# Altium project foxbms2-interface-mc33664.PrjPcb
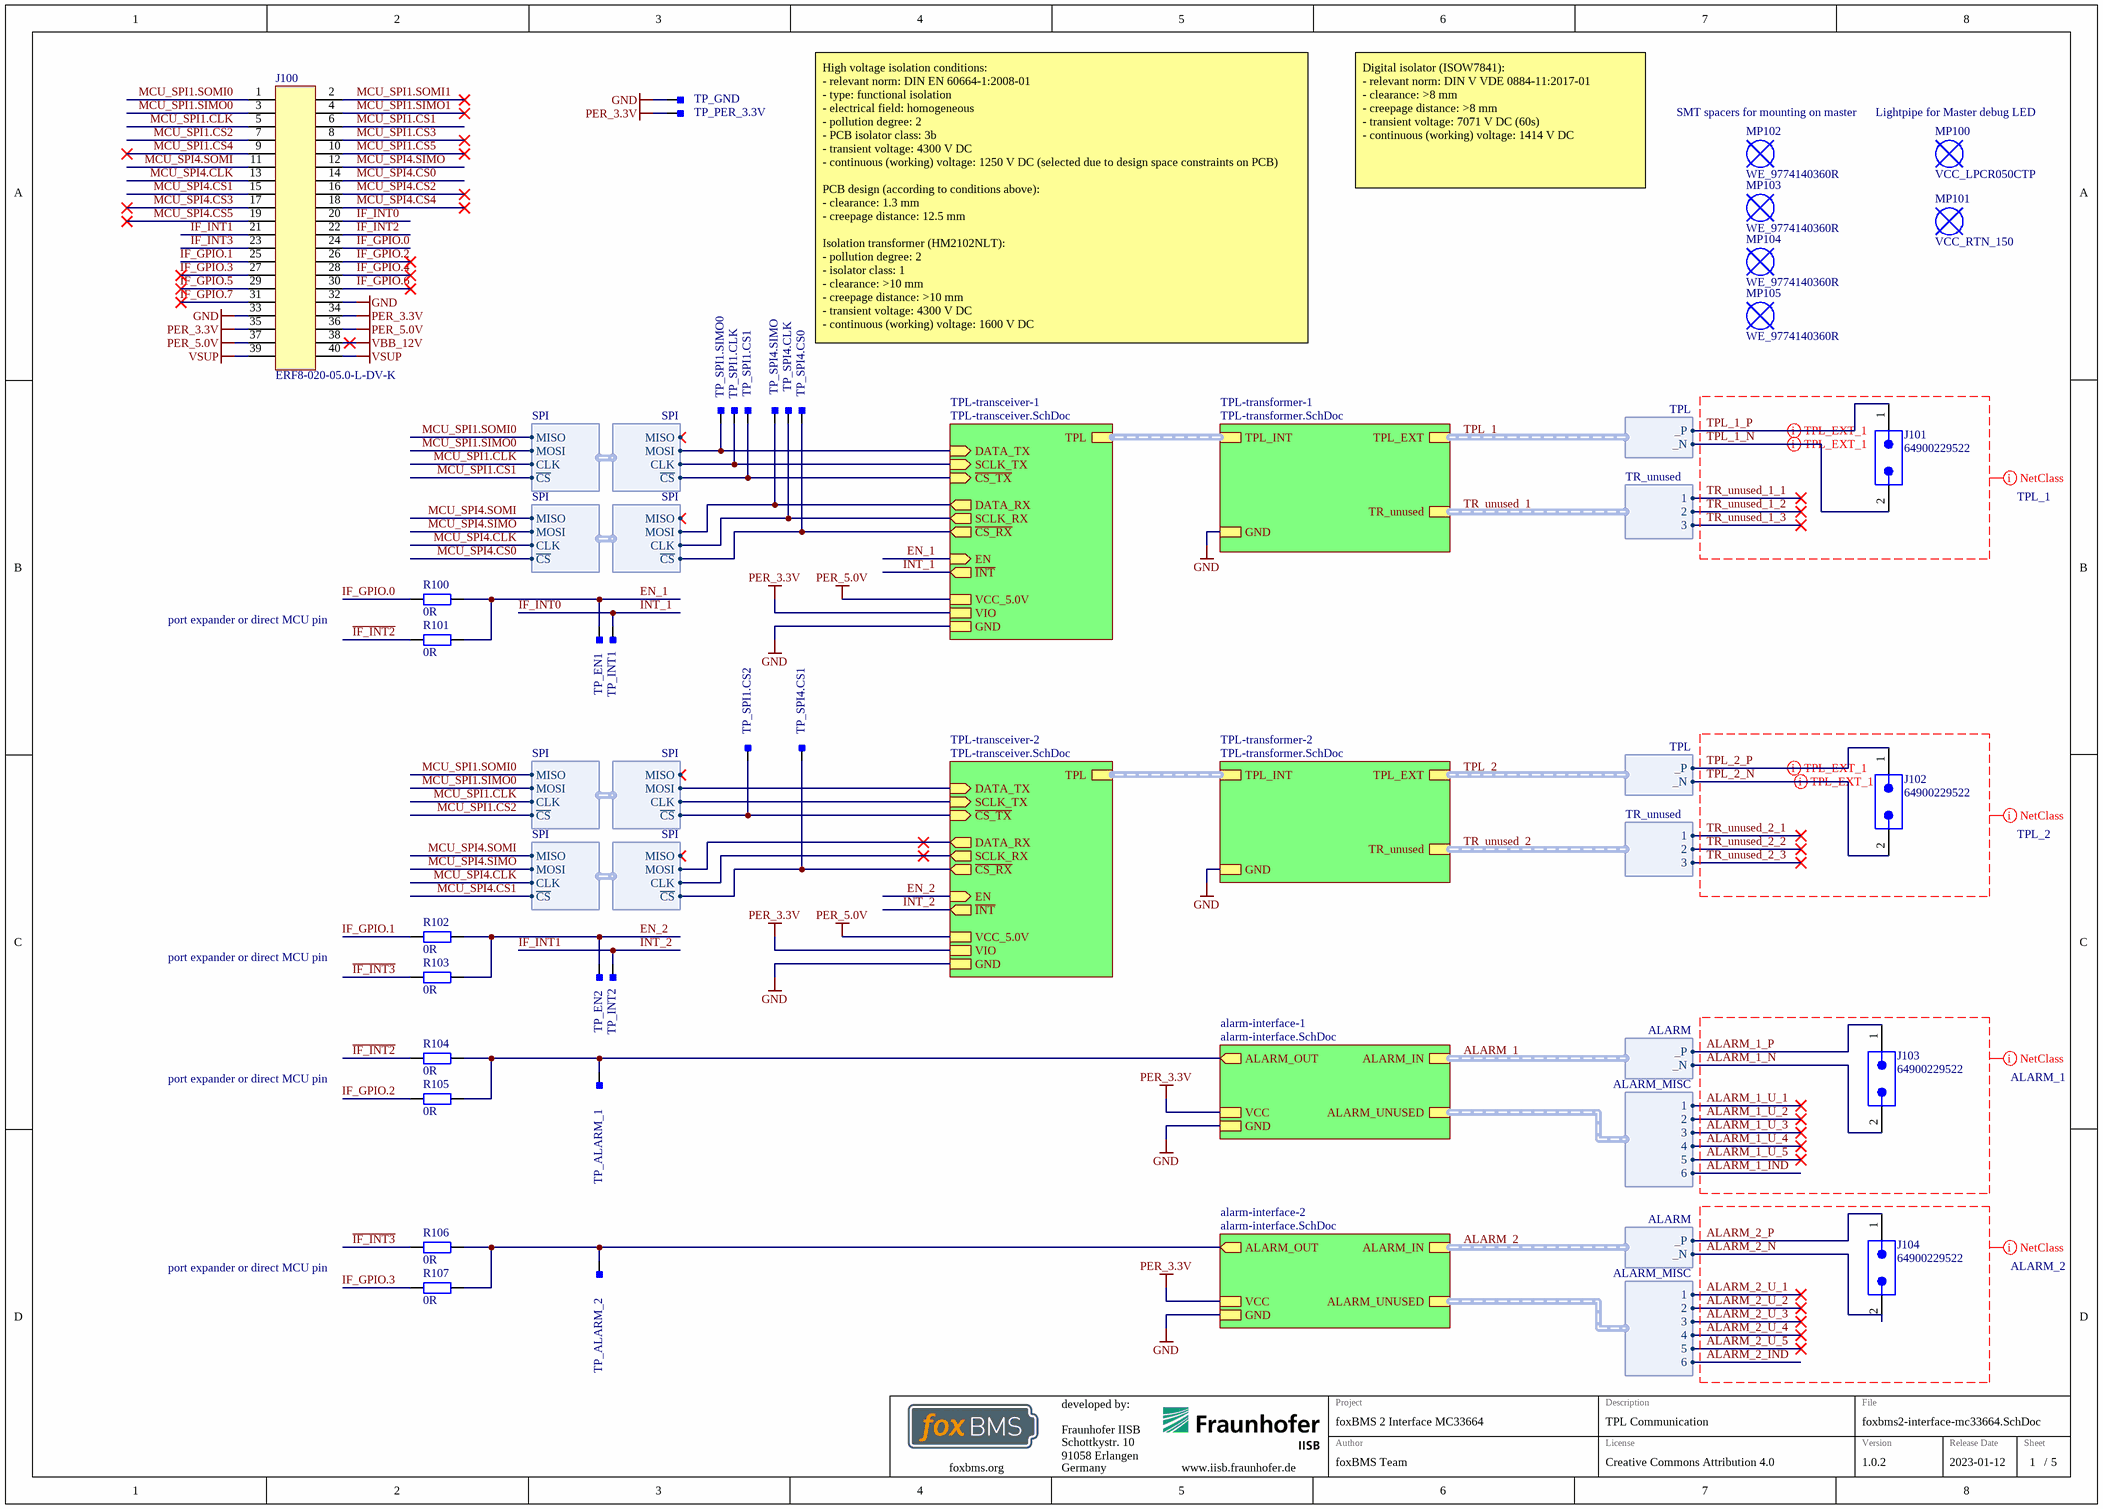
[diagram p0: foxbms2-interface-mc33664.SchDoc]
GlobalDate: 2023-01-12; GlobalLicense: Creative Commons Attribution 4.0; GlobalProject: foxBMS 2 Interface MC33664; GlobalVersion: 1.0.2
5 sheets, 111 parts. Net scope: strictly hierarchical (ports join the sheet entries above them; power ports are local).
Board file: foxbms2-interface-mc33664.PcbDoc
Sheets:
  foxbms2-interface-mc33664.SchDoc
    TPL-transceiver-1 = TPL-transceiver.SchDoc
    TPL-transformer-1 = TPL-transformer.SchDoc
    TPL-transformer-2 = TPL-transformer.SchDoc
    TPL-transceiver-2 = TPL-transceiver.SchDoc
    alarm-interface-1 = alarm-interface.SchDoc
      digital-isolator-alarm = digital-isolator-3in-1out-power.SchDoc
    alarm-interface-2 = alarm-interface.SchDoc
      digital-isolator-alarm = digital-isolator-3in-1out-power.SchDoc

## Sheet foxbms2-interface-mc33664.SchDoc
size A3; DocumentNumber: 1; SheetNumber: 1; SheetTotal: 5; SheetDescription: TPL Communication

### Parts
J100  ERF8-020-05.0-L-DV-K  [SAMTEC_ERF8-020-05.0-L-DV-K]
J101  64900229522  [64900229522]
J102  64900229522  [64900229522]
J103  64900229522  [64900229522]
J104  64900229522  [64900229522]
MP100  VCC_LPCR050CTP  [VCC_LPCR050TP]  (mechanical)
MP101  VCC_RTN_150  [VCC_RTN_150]  (mechanical)
MP102  WE_9774140360R  [WE_9774140360]
MP103  WE_9774140360R  [WE_9774140360]
MP104  WE_9774140360R  [WE_9774140360]
MP105  WE_9774140360R  [WE_9774140360]
R100  0R  [RESC1608X05N]
R101  0R  [RESC1608X05N]
R102  0R  [RESC1608X05N]
R103  0R  [RESC1608X05N]
R104  0R  [RESC1608X05N]
R105  0R  [RESC1608X05N]
R106  0R  [RESC1608X05N]
R107  0R  [RESC1608X05N]
TP_ALARM_1  Testpoint_Square  [Testpoint_S1]  (value not drawn)  (no BOM)
TP_ALARM_2  Testpoint_Square  [Testpoint_S1]  (value not drawn)  (no BOM)
TP_EN1  Testpoint_Square  [Testpoint_S1]  (value not drawn)  (no BOM)
TP_EN2  Testpoint_Square  [Testpoint_S1]  (value not drawn)  (no BOM)
TP_GND  Testpoint_Square  [Testpoint_S1]  (value not drawn)  (no BOM)
TP_INT1  Testpoint_Square  [Testpoint_S1]  (value not drawn)  (no BOM)
TP_INT2  Testpoint_Square  [Testpoint_S1]  (value not drawn)  (no BOM)
TP_PER_3.3V  Testpoint_Square  [Testpoint_S1]  (value not drawn)  (no BOM)
TP_SPI1.CLK  Testpoint_Square  [Testpoint_S1]  (value not drawn)  (no BOM)
TP_SPI1.CS1  Testpoint_Square  [Testpoint_S1]  (value not drawn)  (no BOM)
TP_SPI1.CS2  Testpoint_Square  [Testpoint_S1]  (value not drawn)  (no BOM)
TP_SPI1.SIMO0  Testpoint_Square  [Testpoint_S1]  (value not drawn)  (no BOM)
TP_SPI4.CLK  Testpoint_Square  [Testpoint_S1]  (value not drawn)  (no BOM)
TP_SPI4.CS0  Testpoint_Square  [Testpoint_S1]  (value not drawn)  (no BOM)
TP_SPI4.CS1  Testpoint_Square  [Testpoint_S1]  (value not drawn)  (no BOM)
TP_SPI4.SIMO  Testpoint_Square  [Testpoint_S1]  (value not drawn)  (no BOM)

### Sub-sheets
alarm-interface-1 = alarm-interface.SchDoc: GND, VCC, ALARM_IN (harness ALARM), ALARM_OUT (out), ALARM_UNUSED (harness ALARM_MISC)
alarm-interface-2 = alarm-interface.SchDoc: GND, VCC, ALARM_IN (harness ALARM), ALARM_OUT (out), ALARM_UNUSED (harness ALARM_MISC)
TPL-transceiver-1 = TPL-transceiver.SchDoc: GND, EN (in), TPL (harness TPL), VIO, SCLK_TX (in), ~{CS_RX} (out), ~{INT} (out), DATA_RX (out), ~{CS_TX} (in), VCC_5.0V, DATA_TX (in), SCLK_RX (out)
TPL-transceiver-2 = TPL-transceiver.SchDoc: GND, EN (in), TPL (harness TPL), VIO, SCLK_TX (in), ~{CS_RX} (out), ~{INT} (out), DATA_RX (out), ~{CS_TX} (in), VCC_5.0V, DATA_TX (in), SCLK_RX (out)
TPL-transformer-1 = TPL-transformer.SchDoc: GND, TPL_INT (harness TPL), TPL_EXT (harness TPL), TR_unused (harness TR_unused)
TPL-transformer-2 = TPL-transformer.SchDoc: GND, TPL_INT (harness TPL), TPL_EXT (harness TPL), TR_unused (harness TR_unused)

### Harnesses
SPI: CLK, MOSI, MISO, ~{CS}
TPL: _P, _N
TR_unused: 1, 2, 3
ALARM: _P, _N
ALARM_MISC: 1, 2, 3, 4, 5, 6

### Nets
ALARM_1_N: J103.2 ; sheet alarm-interface-1/ALARM_IN._N  [project net GND_ISO]
ALARM_2_N: J104.2 ; sheet alarm-interface-2/ALARM_IN._N  [project net GND_ISO]
GND: J100.32 J100.33 TP_GND.1 ; sheet TPL-transceiver-1/GND, sheet TPL-transformer-1/GND, sheet TPL-transformer-2/GND, sheet TPL-transceiver-2/GND, sheet alarm-interface-1/GND, sheet alarm-interface-2/GND
PER_3.3V: J100.34 J100.35 TP_PER_3.3V.1 ; sheet TPL-transceiver-1/VIO, sheet TPL-transceiver-2/VIO, sheet alarm-interface-1/VCC, sheet alarm-interface-2/VCC
PER_5.0V: J100.36 J100.37 ; sheet TPL-transceiver-1/VCC_5.0V, sheet TPL-transceiver-2/VCC_5.0V
VBB_12V: J100.38
VSUP: J100.39 J100.40
~{IF_INT0}: J100.20 TP_INT1.1 ; sheet TPL-transceiver-1/~{INT}  [also labelled ~{INT_1}]
~{IF_INT1}: J100.21 TP_INT2.1 ; sheet TPL-transceiver-2/~{INT}  [also labelled ~{INT_2}]
~{IF_INT2}: J100.22 R101.1 R104.1
~{IF_INT3}: J100.23 R103.1 R106.1
~{MCU_SPI1.CS1}: J100.6 TP_SPI1.CS1.1 ; sheet TPL-transceiver-1/~{CS_TX}, harness SPI.~{CS}
~{MCU_SPI1.CS2}: J100.7 TP_SPI1.CS2.1 ; sheet TPL-transceiver-2/~{CS_TX}, harness SPI.~{CS}
~{MCU_SPI1.CS3}: J100.8
~{MCU_SPI1.CS4}: J100.9
~{MCU_SPI1.CS5}: J100.10
~{MCU_SPI4.CS0}: J100.14 TP_SPI4.CS0.1 ; sheet TPL-transceiver-1/~{CS_RX}, harness SPI.~{CS}
~{MCU_SPI4.CS1}: J100.15 TP_SPI4.CS1.1 ; sheet TPL-transceiver-2/~{CS_RX}, harness SPI.~{CS}
~{MCU_SPI4.CS2}: J100.16
~{MCU_SPI4.CS3}: J100.17
~{MCU_SPI4.CS4}: J100.18
~{MCU_SPI4.CS5}: J100.19
ALARM_1_P: J103.1 ; sheet alarm-interface-1/ALARM_IN._P  [project net ALARM_1._P]
ALARM_2_P: J104.1 ; sheet alarm-interface-2/ALARM_IN._P  [project net ALARM_2._P]
ALARM_OUT: R104.2 R105.2 TP_ALARM_1.1 ; sheet alarm-interface-1/ALARM_OUT
ALARM_OUT: R106.2 R107.2 TP_ALARM_2.1 ; sheet alarm-interface-2/ALARM_OUT  [a separate net that carries the same name]
EN_1: R100.2 R101.2 TP_EN1.1 ; sheet TPL-transceiver-1/EN
EN_2: R102.2 R103.2 TP_EN2.1 ; sheet TPL-transceiver-2/EN
IF_GPIO.0: J100.24 R100.1
IF_GPIO.1: J100.25 R102.1
IF_GPIO.2: J100.26 R105.1
IF_GPIO.3: J100.27 R107.1
IF_GPIO.4: J100.28
IF_GPIO.5: J100.29
IF_GPIO.6: J100.30
IF_GPIO.7: J100.31
MCU_SPI1.CLK: J100.5 TP_SPI1.CLK.1 ; sheet TPL-transceiver-1/SCLK_TX, sheet TPL-transceiver-2/SCLK_TX, harness SPI.CLK
MCU_SPI1.SIMO0: J100.3 TP_SPI1.SIMO0.1 ; sheet TPL-transceiver-1/DATA_TX, sheet TPL-transceiver-2/DATA_TX, harness SPI.MOSI
MCU_SPI1.SIMO1: J100.4
MCU_SPI1.SOMI0: J100.1 ; harness SPI.MISO
MCU_SPI1.SOMI1: J100.2
MCU_SPI4.CLK: J100.13 TP_SPI4.CLK.1 ; sheet TPL-transceiver-1/SCLK_RX, sheet TPL-transceiver-2/SCLK_RX, harness SPI.CLK
MCU_SPI4.SIMO: J100.12 TP_SPI4.SIMO.1 ; sheet TPL-transceiver-1/DATA_RX, sheet TPL-transceiver-2/DATA_RX, harness SPI.MOSI
MCU_SPI4.SOMI: J100.11 ; harness SPI.MISO
TPL_1_N: J101.2 ; sheet TPL-transformer-1/TPL_EXT._N  [project net TPL_1._N]
TPL_1_P: J101.1 ; sheet TPL-transformer-1/TPL_EXT._P  [project net TPL_1._P]
TPL_2_N: J102.2 ; sheet TPL-transformer-2/TPL_EXT._N  [project net TPL_2._N]
TPL_2_P: J102.1 ; sheet TPL-transformer-2/TPL_EXT._P  [project net TPL_2._P]

### Buses and harness runs
harness ALARM_1 = sheet alarm-interface-1/ALARM_IN
harness ALARM_2 = sheet alarm-interface-2/ALARM_IN
harness sheet TPL-transceiver-1/TPL = sheet TPL-transformer-1/TPL_INT
harness sheet TPL-transceiver-2/TPL = sheet TPL-transformer-2/TPL_INT
harness TPL_1 = sheet TPL-transformer-1/TPL_EXT
harness TPL_2 = sheet TPL-transformer-2/TPL_EXT
harness TR_unused_1 = sheet TPL-transformer-1/TR_unused
harness TR_unused_2 = sheet TPL-transformer-2/TR_unused

### Layout directives
net class TPL_1: TPL_1_N, TPL_1_P, TR_unused_1_1, TR_unused_1_2, TR_unused_1_3
net class TPL_2: TPL_2_N, TPL_2_P, TR_unused_2_1, TR_unused_2_2, TR_unused_2_3
differential pair: TPL_1._N, TPL_1._P, TPL_2._N, TPL_2._P
net class ALARM_1: ALARM_1_IND, ALARM_1_N, ALARM_1_P, ALARM_1_U_1, ALARM_1_U_2, ALARM_1_U_3, ALARM_1_U_4, ALARM_1_U_5
net class ALARM_2: ALARM_2_IND, ALARM_2_N, ALARM_2_P, ALARM_2_U_1, ALARM_2_U_2, ALARM_2_U_3, ALARM_2_U_4, ALARM_2_U_5

### Notes on the sheet
- Digital isolator (ISOW7841):
  - relevant norm: DIN V VDE 0884-11:2017-01
  - clearance: >8 mm
  - creepage distance: >8 mm
  - transient voltage: 7071 V DC (60s)
  - continuous (working) voltage: 1414 V DC
- (near MP102) SMT spacers for mounting on master
- (near MP100) Lightpipe for Master debug LED
- High voltage isolation conditions:
  - relevant norm: DIN EN 60664-1:2008-01
  - type: functional isolation
  - electrical field: homogeneous
  - pollution degree: 2
  - PCB isolator class: 3b
  - transient voltage: 4300 V DC
  - continuous (working) voltage: 1250 V DC (selected due to design space constraints on PCB)
  PCB design (according to conditions above):
  - clearance: 1.3 mm
  - creepage distance: 12.5 mm
  Isolation transformer (HM2102NLT):
  - pollution degree: 2
  - isolator class: 1
  - clearance: >10 mm
  - creepage distance: >10 mm
  - transient voltage: 4300 V DC
  - continuous (working) voltage: 1600 V DC
- port expander or direct MCU pin
- Fraunhofer IISB
- Schottkystr. 10
- developed by:
- 91058 Erlangen
- Germany
- Author
- Project
- License
- Description
- File
- Version
- Release Date
- Sheet
- foxbms.org <https://foxbms.org>
- www.iisb.fraunhofer.de <https://www.iisb.fraunhofer.de/>
- foxBMS Team
- /

### Library data of the parts
J100 = SAMTEC_ERF8-020-05.0-L-DV-K: Edge Rate rugged high-speed connector strips; Manufacturer: Samtec; Circuits: 40; Automotive Qualified: False; Part Number: SAMTEC_ERF8-020-05.0-L-DV-K; Part Name: ERF8-020-05.0-L-DV-K; Operating Temperature: -55°C - +125°C; ComponentLink1Description: Datasheet; ComponentLink1URL: https://suddendocs.samtec.com/catalog_english/erf8-s.pdf; Supplier 1: Farnell; Supplier Part Number 1: 3771957; Supplier 2: Digikey; Supplier Part Number 2: SAM13550CT-ND; Supplier 3: Mouser; Supplier Part Number 3: 200-ERF8020050LDVKTR; ECCN: EAR99; System: Connector
J101-J104 = CMP-1502-00517-2: NexarPartId: 8917583; Operating Supply Voltage: 600V; Connector Type: Male Pin, Socket; Gender: Male; Current Rating: 9A; Insulation: Insulated; Insulation Resistance: 1GΩ; Number of Positions: 2; Contact Resistance: 10mΩ; Row Spacing: 5.5118mm; Pitch: 4.2mm; Contact Material: Copper; RoHS: Compliant; Lead Pitch: 4.2mm; Min Operating Temperature: -40°C; Housing Material: Nylon; Width: 5.4mm; Color: White; Number of Pins: 2; Mount: Through Hole; Number of Rows: 2; Fastening Type: Ramp; Flammability Rating: UL94 V-0; Termination: Through Hole; Height: 12.8mm; Length: 5.4mm; Contact Plating: Tin; Contact Gender: Male; Number of Contacts: 2; Max Operating Temperature: 105°C; REACH SVHC: Unknown; Voltage Rating: 600V
MP100 = VCC_LPCR050CTP: Lightpipe Clear LPCR Series; Manufacturer: VCC; Automotive Qualified: False; Part Number: VCC_LPCR050CTP; Part Name: VCC_LPCR050CTP; ComponentLink1Description: Datasheet; ComponentLink1URL: https://vcclite.com/wp-content/uploads/wpallimport/files/files/LPCR.pdf; Supplier 1: Digikey; Supplier Part Number 1: LPCR050CTP-ND; Supplier 2: Mouser; Supplier Part Number 2: 593-LPCR050CTP; ECCN: EAR99
MP101 = VCC_RTN_150: Grommet Retainer for LPC and LPCR Series Light Pipe; Manufacturer: VCC; Automotive Qualified: False; Part Number: VCC_RTN_150; Part Name: VCC_RTN_150; ComponentLink1Description: Datasheet; ComponentLink1URL: https://vcclite.com/?file=files/RTN_150.pdf&file_name=RTN_150.pdf; Supplier 1: Digikey; Supplier Part Number 1: RTN_150-ND; Supplier 2: Mouser; Supplier Part Number 2: 593-RTN150; ECCN: EAR99
MP102-MP105 = WE_9774140360R: WA-SMSI SMT Steel Spacer with internal thread M 3; Manufacturer: Würth Elektronik; Automotive Qualified: False; Part Number: WE_9774140360R; Part Name: WE_9774140360R; Operating Temperature: -55°C - +150°C; ComponentLink1Description: Datasheet; ComponentLink1URL: https://www.we-online.com/catalog/datasheet/9774140360R.pdf; Supplier 1: Digikey; Supplier Part Number 1: 732-5281-1-ND; Supplier 2: Mouser; Supplier Part Number 2: 710-9774140360R; ECCN: EAR99
R100-R107 = gen_R_0R_0603: SMD Resistor 0R 0603; Power: 0.1W; Case EIA: 0603; Case Metric: 1608; Maximum Working Voltage: 75V; PnP Package: 0603R; PnP equipped: x; Automotive Qualified: True; Part Number: gen_R_0R_0603; Operating Temperature: -55°C - +155°C; Resistance: 0R; Series: Jumper; PnP Value: 0R; Supplier 1: Farnell; Supplier Part Number 1: 2616580
TP_ALARM_1 TP_ALARM_2 TP_EN1 TP_EN2 TP_GND TP_INT1 TP_INT2 TP_PER_3.3V TP_SPI1.CLK TP_SPI1.CS1 TP_SPI1.CS2 TP_SPI1.SIMO0 TP_SPI4.CLK TP_SPI4.CS0 TP_SPI4.CS1 TP_SPI4.SIMO = Testpoint_Square: Testpoint, square; Automotive Qualified: False; Part Number: Testpoint_Square

## Sheet TPL-transceiver.SchDoc
size A3; DocumentNumber: 4; SheetNumber: 4; SheetTotal: 5; SheetDescription: TPL Transceiver
Used 2 times, as channels TPL-transceiver-1, TPL-transceiver-2. Parts and nets are listed once, with the designators drawn on the sheet.
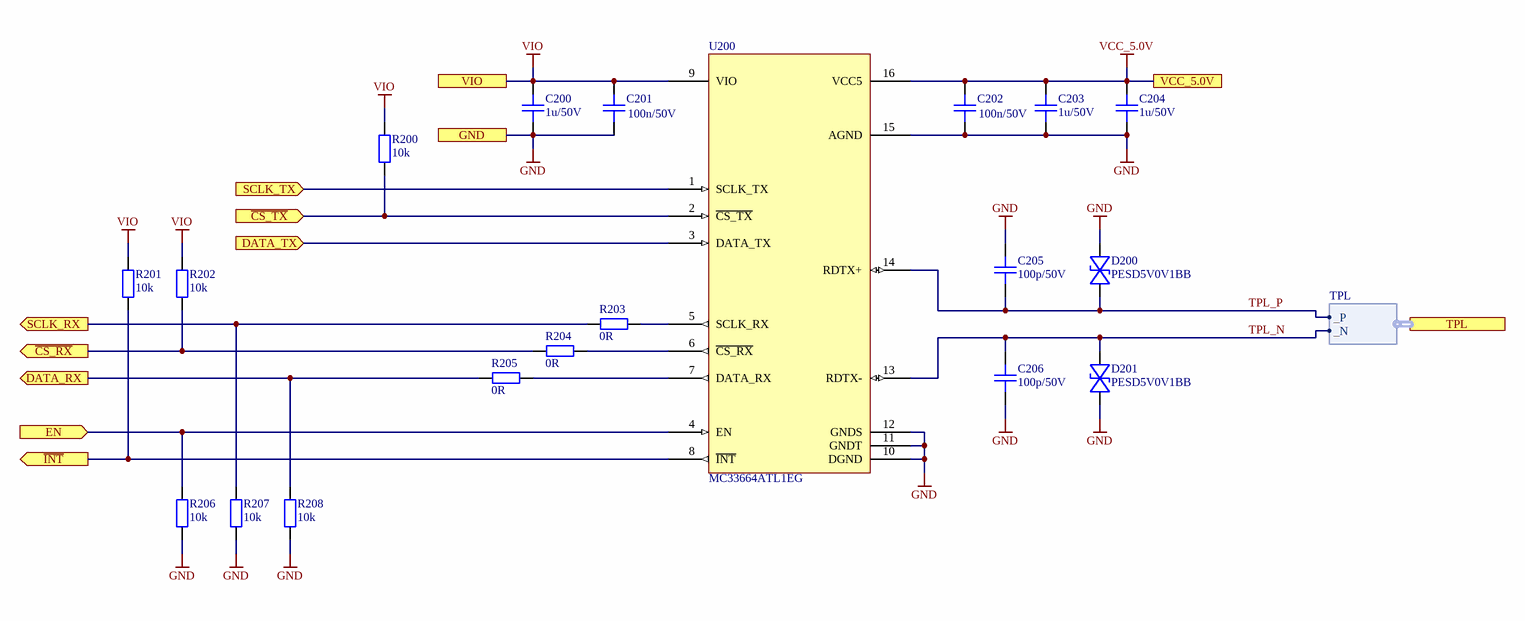
[diagram p1: TPL-transceiver.SchDoc]

### Parts
C200  1u/50V  [CAPC2012X14N]
C201  100n/50V  [CAPC1608X08N]
C202  100n/50V  [CAPC1608X08N]
C203  1u/50V  [CAPC2012X14N]
C204  1u/50V  [CAPC2012X14N]
C205  100p/50V  [CAPC1608X08N]
C206  100p/50V  [CAPC1608X08N]
D200  PESD5V0V1BB  [SOD523_PESD_NEXPERIA]
D201  PESD5V0V1BB  [SOD523_PESD_NEXPERIA]
R200  10k  [RESC1608X05N]
R201  10k  [RESC1608X05N]
R202  10k  [RESC1608X05N]
R203  0R  [RESC1608X05N]
R204  0R  [RESC1608X05N]
R205  0R  [RESC1608X05N]
R206  10k  [RESC1608X05N]
R207  10k  [RESC1608X05N]
R208  10k  [RESC1608X05N]
U200  MC33664ATL1EG  [MC33664ATL1EG]

### Ports
DATA_RX (out), DATA_TX (in), EN (in), GND, SCLK_RX (out), SCLK_TX (in), TPL (harness TPL), VCC_5.0V, VIO, ~{CS_RX} (out), ~{CS_TX} (in), ~{INT} (out)

### Harnesses
TPL: _P, _N

### Nets
GND: C200.1 C201.1 C202.1 C203.1 C204.1 C205.2 C206.1 D200.1(C) D201.2(A) R206.1 R207.1 R208.1 U200.10(DGND) U200.11(GNDT) U200.12(GNDS) U200.15(AGND) ; port GND
VCC_5.0V: C202.2 C203.2 C204.2 U200.16(VCC5) ; port VCC_5.0V
VIO: C200.2 C201.2 R200.2 R201.2 R202.2 U200.9(VIO) ; port VIO
~{CS_RX}: R202.1 R204.1 ; port ~{CS_RX}
~{CS_TX}: R200.1 U200.2(~{CS_TX}) ; port ~{CS_TX}
~{INT}: R201.1 U200.8(~{INT}) ; port ~{INT}
DATA_RX: R205.1 R208.2 ; port DATA_RX
DATA_TX: U200.3(DATA_TX) ; port DATA_TX
EN: R206.2 U200.4(EN) ; port EN
SCLK_RX: R203.1 R207.2 ; port SCLK_RX
SCLK_TX: U200.1(SCLK_TX) ; port SCLK_TX
TPL_N: C206.2 D201.1(C) U200.13(RDTX-) ; port TPL._N
TPL_P: C205.1 D200.2(A) U200.14(RDTX+) ; port TPL._P
NetR203_2: R203.2 U200.5(SCLK_RX)
NetR204_2: R204.2 U200.6(~{CS_RX})
NetR205_2: R205.2 U200.7(DATA_RX)

### Channels
TPL-transceiver-1: designators end in _1; ports DATA_RX=MCU_SPI4.SIMO DATA_TX=MCU_SPI1.SIMO0 EN=EN_1 GND=GND SCLK_RX=MCU_SPI4.CLK SCLK_TX=MCU_SPI1.CLK VCC_5.0V=PER_5.0V VIO=PER_3.3V ~{CS_RX}=~{MCU_SPI4.CS0} ~{CS_TX}=~{MCU_SPI1.CS1} ~{INT}=~{IF_INT0}
TPL-transceiver-2: designators end in _2; ports DATA_RX=MCU_SPI4.SIMO DATA_TX=MCU_SPI1.SIMO0 EN=EN_2 GND=GND SCLK_RX=MCU_SPI4.CLK SCLK_TX=MCU_SPI1.CLK VCC_5.0V=PER_5.0V VIO=PER_3.3V ~{CS_RX}=~{MCU_SPI4.CS1} ~{CS_TX}=~{MCU_SPI1.CS2} ~{INT}=~{IF_INT1}

### Notes on the sheet
- Fraunhofer IISB
- Schottkystr. 10
- developed by:
- 91058 Erlangen
- Germany
- Author
- Project
- License
- Description
- File
- Version
- Release Date
- Sheet
- foxbms.org <https://foxbms.org>
- www.iisb.fraunhofer.de <https://www.iisb.fraunhofer.de/>
- foxBMS Team
- /

### Library data of the parts
C200 C203 C204 = gen_C_ceramic_1u_50V_X7R_0805: MLCC; Capacitance: 1u; Rated Voltage: 50V; Dielectric: X7R; Tolerance: ± 10%; Case EIA: 0805; Case Metric: 2012; AVT Set: x; Automotive Qualified: True; Part Number: gen_C_ceramic_1u_50V_X7R_0805; Operating Temperature: -55°C - +125°C; Supplier 1: Farnell; Supplier Part Number 1: 2672199; Supplier 2: Farnell; Supplier Part Number 2: 2479894; Supplier 3: Farnell; Supplier Part Number 3: 2464630
C201 C202 = gen_C_ceramic_100n_50V_X7R_0603: MLCC; Capacitance: 100n; Rated Voltage: 50V; Dielectric: X7R; Case EIA: 0603; Case Metric: 1608; PnP Package: 0603C; PnP Value: 100nF/50V/X7R; PnP equipped: x; Automotive Qualified: True; AEC-Q Norm: AEC-Q200; Part Number: gen_C_ceramic_100n_50V_X7R_0603; Supplier 1: Farnell; Supplier Part Number 1: 2525267; ECCN: EAR99; Supplier 2: Digikey; Supplier Part Number 2: 490-6049-1-ND
C205 C206 = gen_C_ceramic_100p_50V_C0G_0603: MLCC; Capacitance: 100p; Rated Voltage: 50V; Dielectric: C0G; Tolerance: ± 10%; Case EIA: 0603; Case Metric: 1608; PnP Package: 0603C; PnP Value: 100pF/50V/NP0; PnP equipped: x; Automotive Qualified: True; AEC-Q Norm: AEC-Q200; Part Number: gen_C_ceramic_100p_50V_C0G_0603; Supplier 1: Farnell; Supplier Part Number 1: 2478236; ECCN: EAR99
D200 D201 = PESD5V0V1BB: Very low capacitance bidirectional ESD protection diode; Manufacturer: Nexperia; Breakdown Voltage: 6.8V; PnP Package: SOD523; Automotive Qualified: True; AEC-Q Norm: AEC-Q101; Part Number: PESD5V0V1BB; Part Name: PESD5V0V1BB; Operating Temperature: -55°C - +150°C; Continuous Forward Current: *; ComponentLink1Description: Datasheet; ComponentLink1URL: https://assets.nexperia.com/documents/data-sheet/PESD5V0V1BB.pdf; Supplier 1: Mouser; Supplier Part Number 1: 771-PESD5V0V1BB115; Supplier 2: Digikey; Supplier Part Number 2: 1727-5808-1-ND; Supplier 3: Farnell; Supplier Part Number 3: 2069367; ECCN: EAR99
R200-R202 R206-R208 = gen_R_10k_0603: SMD Resistor 10k 0603; Tolerance: 1%; Power: 0.1W; Case EIA: 0603; Case Metric: 1608; Maximum Working Voltage: 75V; PnP Package: 0603R; Automotive Qualified: True; PnP equipped: x; Part Number: gen_R_10k_0603; Operating Temperature: -55°C - +155°C; Resistance: 10k; Series: E24, E96; PnP Value: 10k; Supplier 1: Farnell; Supplier Part Number 1: 2073349
R203-R205 = gen_R_0R_0603: as R100 on sheet foxbms2-interface-mc33664; Part Number: gen_R_0R_0603; Operating Temperature: -55°C - +155°C; Resistance: 0R; Series: Jumper; PnP Value: 0R; Supplier 1: Farnell; Supplier Part Number 1: 2616580
U200 = MC33664ATL1EG: Isolated network high-speed transceiver; Manufacturer: NXP; PnP Package: SOT109-5; Automotive Qualified: True; Part Number: MC33664ATL1EG; Part Name: MC33664ATL1EG; Operating Temperature: -40°C - +125°C; ComponentLink1Description: Datasheet; ComponentLink1URL: https://www.nxp.com/docs/en/data-sheet/MC33664_SDS.pdf; Supplier 1: Mouser; Supplier Part Number 1: 841-MC33664ATL1EG; Supplier 2: Digikey; Supplier Part Number 2: 568-13893-ND / 568-13893-ND; Supplier 3: Farnell; Supplier Part Number 3: 2890308; ECCN: EAR99

## Sheet TPL-transformer.SchDoc
size A3; DocumentNumber: 5; SheetNumber: 5; SheetTotal: 5; SheetDescription: TPL Transformer
Used 2 times, as channels TPL-transformer-1, TPL-transformer-2. Parts and nets are listed once, with the designators drawn on the sheet.
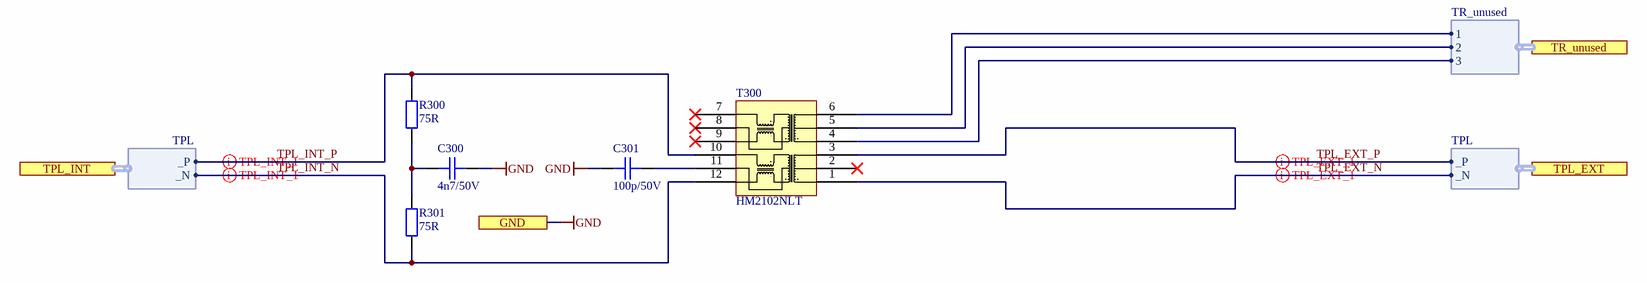
[diagram p2: TPL-transformer.SchDoc]

### Parts
C300  4n7/50V  [CAPC1608X08N]
C301  100p/50V  [CAPC1608X08N]
R300  75R  [RESC1608X05N]
R301  75R  [RESC1608X05N]
T300  HM2102NLT  [HM2102NL]

### Ports
GND, TPL_EXT (harness TPL), TPL_INT (harness TPL), TR_unused (harness TR_unused)

### Harnesses
TPL: _P, _N
TR_unused: 1, 2, 3

### Nets
GND: C300.2 C301.1 ; port GND
TPL_EXT_N: T300.1 ; port TPL_EXT._N
TPL_EXT_P: T300.3 ; port TPL_EXT._P
TPL_INT_N: R301.1 T300.12 ; port TPL_INT._N
TPL_INT_P: R300.2 T300.10 ; port TPL_INT._P
NetC300_1: C300.1 R300.1 R301.2
NetC301_2: C301.2 T300.11
NetT300_4: T300.4 ; port TR_unused.3
NetT300_5: T300.5 ; port TR_unused.2
NetT300_6: T300.6 ; port TR_unused.1

Not connected (* = marked no-connect by the designer): T300 2* 7* 8* 9*

### Channels
TPL-transformer-1: designators end in _1; ports GND=GND
TPL-transformer-2: designators end in _2; ports GND=GND

### Layout directives
differential pair: TPL_1._N, TPL_1._P, TPL_INT_N, TPL_INT_P

### Notes on the sheet
- Fraunhofer IISB
- Schottkystr. 10
- developed by:
- 91058 Erlangen
- Germany
- Author
- Project
- License
- Description
- File
- Version
- Release Date
- Sheet
- foxbms.org <https://foxbms.org>
- www.iisb.fraunhofer.de <https://www.iisb.fraunhofer.de/>
- foxBMS Team
- /

### Library data of the parts
C300 = gen_C_ceramic_4n7_50V_X7R_0603: MLCC; Capacitance: 4n7; Rated Voltage: 50V; Dielectric: X7R; Case EIA: 0603; Case Metric: 1608; PnP Package: 0603C; Automotive Qualified: True; Part Number: gen_C_ceramic_4n7_50V_X7R_0603; Supplier 1: Farnell; Supplier Part Number 1: 2904754
C301 = gen_C_ceramic_100p_50V_C0G_0603: as C205 on sheet TPL-transceiver; Part Number: gen_C_ceramic_100p_50V_C0G_0603; Supplier 1: Farnell; Supplier Part Number 1: 2478236; ECCN: EAR99
R300 R301 = gen_R_75R_0603: SMD Resistor 75R 0603; Tolerance: 1%; Power: 0.1W; Case EIA: 0603; Case Metric: 1608; Maximum Working Voltage: 75V; PnP Package: 0603R; Automotive Qualified: True; AEC-Q Grade: Grade 0; AEC-Q Norm: AEC-Q200; Part Number: gen_R_75R_0603; Operating Temperature: -55°C - +155°C; Resistance: 75R; Series: E24, E96; PnP Value: 75R; ECCN: EAR99; Supplier 1: Mouser; Supplier Part Number 1: 667-ERJ-UP3F75R0V
T300 = HM2102NLT: Pulse HM2102NLT BMS Transformer; Automotive Qualified: True; AEC-Q Norm: AEC-Q200; Part Number: HM2102NLT; Manufacturer: Pulse; Operating Temperature: -40°C - +125°C; ComponentLink1Description: Datasheet; ComponentLink1URL: https://www.mouser.de/datasheet/2/336/HM2102NL-1218600.pdf; Supplier 1: Mouser; Supplier Part Number 1: 673-HM2102NLT; Supplier 2: Digikey; Supplier Part Number 2: 1840-1034-1-ND; ECCN: EAR99

## Sheet alarm-interface.SchDoc
size A3; DocumentNumber: 2; SheetNumber: 2; SheetTotal: 5; SheetDescription: Alarm Interface
Used 2 times, as channels alarm-interface-1, alarm-interface-2. Parts and nets are listed once, with the designators drawn on the sheet.
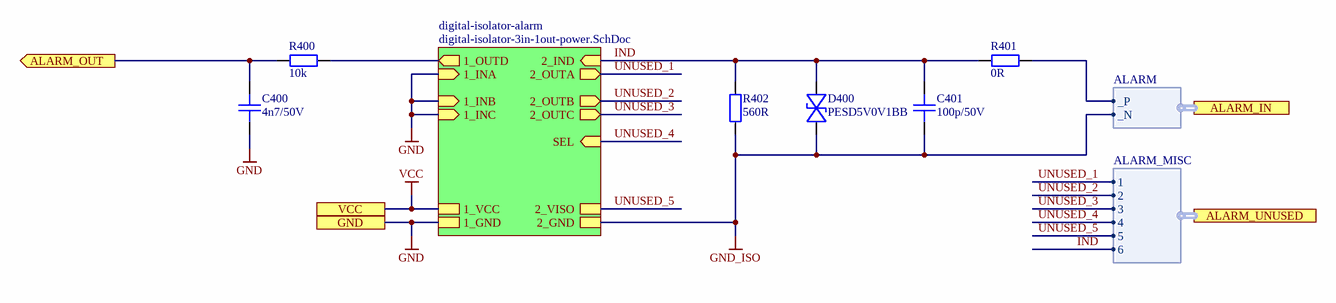
[diagram p3: alarm-interface.SchDoc]

### Parts
C400  4n7/50V  [CAPC1608X08N]
C401  100p/50V  [CAPC1608X08N]
D400  PESD5V0V1BB  [SOD523_PESD_NEXPERIA]
R400  10k  [RESC1608X05N]
R401  0R  [RESC1608X05N]
R402  560R  [RESC1608X05N]

### Sub-sheets
digital-isolator-alarm = digital-isolator-3in-1out-power.SchDoc: 2_OUTA (out), 1_VCC, 2_OUTB (out), 2_GND, 2_IND (in), 1_INA (in), 1_INB (in), 1_INC (in), 1_GND, 1_OUTD (out), 2_OUTC (out), 2_VISO, SEL (in)

### Ports
ALARM_IN (harness ALARM), ALARM_OUT (out), ALARM_UNUSED (harness ALARM_MISC), GND, VCC

### Harnesses
ALARM: _P, _N
ALARM_MISC: 1, 2, 3, 4, 5, 6

### Nets
GND: C400.1 ; port GND, sheet digital-isolator-alarm/1_INA, sheet digital-isolator-alarm/1_INB, sheet digital-isolator-alarm/1_INC, sheet digital-isolator-alarm/1_GND
GND_ISO: C401.1 D400.2(A) R402.2 ; sheet digital-isolator-alarm/2_GND, port ALARM_IN._N
VCC: port VCC, sheet digital-isolator-alarm/1_VCC
ALARM_OUT: C400.2 R400.2 ; port ALARM_OUT
IND: C401.2 D400.1(C) R401.1 R402.1 ; sheet digital-isolator-alarm/2_IND, port ALARM_UNUSED.6
UNUSED_1: sheet digital-isolator-alarm/2_OUTA, port ALARM_UNUSED.1
UNUSED_2: sheet digital-isolator-alarm/2_OUTB, port ALARM_UNUSED.2
UNUSED_3: sheet digital-isolator-alarm/2_OUTC, port ALARM_UNUSED.3
UNUSED_4: sheet digital-isolator-alarm/SEL, port ALARM_UNUSED.4
UNUSED_5: sheet digital-isolator-alarm/2_VISO, port ALARM_UNUSED.5
NetR400_1: R400.1 ; sheet digital-isolator-alarm/1_OUTD
NetR401_2: R401.2 ; port ALARM_IN._P

### Channels
alarm-interface-1: designators end in _1; ports ALARM_OUT=ALARM_OUT GND=GND VCC=PER_3.3V
alarm-interface-2: designators end in _2; ports ALARM_OUT=ALARM_OUT GND=GND VCC=PER_3.3V

### Notes on the sheet
- Fraunhofer IISB
- Schottkystr. 10
- developed by:
- 91058 Erlangen
- Germany
- Author
- Project
- License
- Description
- File
- Version
- Release Date
- Sheet
- foxbms.org <https://foxbms.org>
- www.iisb.fraunhofer.de <https://www.iisb.fraunhofer.de/>
- foxBMS Team
- /

### Library data of the parts
C400 = gen_C_ceramic_4n7_50V_X7R_0603: as C300 on sheet TPL-transformer; Part Number: gen_C_ceramic_4n7_50V_X7R_0603; Supplier 1: Farnell; Supplier Part Number 1: 2904754
C401 = gen_C_ceramic_100p_50V_C0G_0603: as C205 on sheet TPL-transceiver; Part Number: gen_C_ceramic_100p_50V_C0G_0603; Supplier 1: Farnell; Supplier Part Number 1: 2478236; ECCN: EAR99
D400 = PESD5V0V1BB: as D200 on sheet TPL-transceiver; Part Number: PESD5V0V1BB; Part Name: PESD5V0V1BB; Operating Temperature: -55°C - +150°C; Continuous Forward Current: *; ComponentLink1Description: Datasheet; ComponentLink1URL: https://assets.nexperia.com/documents/data-sheet/PESD5V0V1BB.pdf; Supplier 1: Mouser; Supplier Part Number 1: 771-PESD5V0V1BB115; Supplier 2: Digikey; Supplier Part Number 2: 1727-5808-1-ND; Supplier 3: Farnell; Supplier Part Number 3: 2069367; ECCN: EAR99
R400 = gen_R_10k_0603: as R200 on sheet TPL-transceiver; Part Number: gen_R_10k_0603; Operating Temperature: -55°C - +155°C; Resistance: 10k; Series: E24, E96; PnP Value: 10k; Supplier 1: Farnell; Supplier Part Number 1: 2073349
R401 = gen_R_0R_0603: as R100 on sheet foxbms2-interface-mc33664; Part Number: gen_R_0R_0603; Operating Temperature: -55°C - +155°C; Resistance: 0R; Series: Jumper; PnP Value: 0R; Supplier 1: Farnell; Supplier Part Number 1: 2616580
R402 = gen_R_560R_0603: SMD Resistor 560R 0603; Tolerance: 1%; Power: 0.1W; Case EIA: 0603; Case Metric: 1608; Maximum Working Voltage: 75V; PnP Package: 0603R; Automotive Qualified: True; AEC-Q Grade: Grade 0; AEC-Q Norm: AEC-Q200; Part Number: gen_R_560R_0603; Operating Temperature: -55°C - +155°C; Resistance: 560R; Series: E24; PnP Value: 560R; ECCN: EAR99; Supplier 1: Mouser; Supplier Part Number 1: 667-ERJ-UP3F5600V

## Sheet digital-isolator-3in-1out-power.SchDoc
size A3; DocumentNumber: 3; SheetNumber: 3; SheetTotal: 5; SheetDescription: Digital Isolator 3x in / 1x out with power
Used 2 times, as channels alarm-interface-1/digital-isolator-alarm, alarm-interface-2/digital-isolator-alarm. Parts and nets are listed once, with the designators drawn on the sheet.
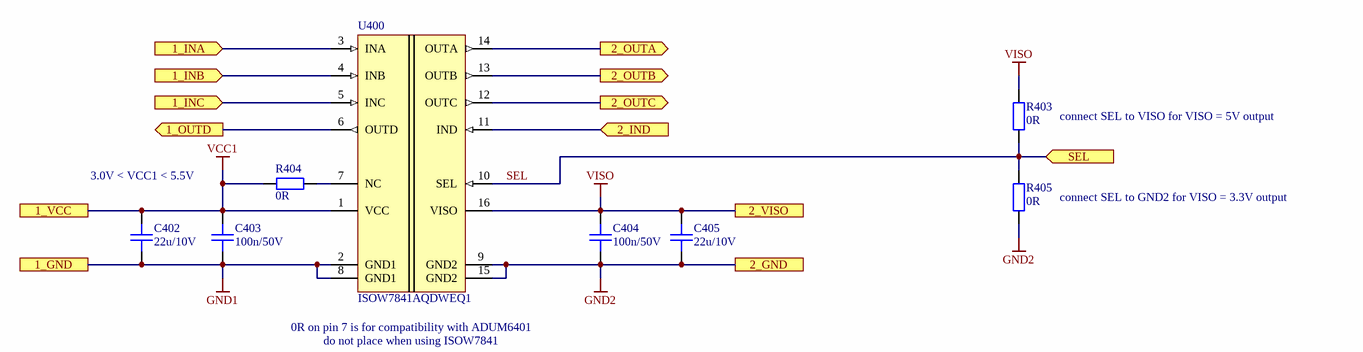
[diagram p4: digital-isolator-3in-1out-power.SchDoc]

### Parts
C402  22u/10V  [CAPC3216X18N]
C403  100n/50V  [CAPC1608X08N]
C404  100n/50V  [CAPC1608X08N]
C405  22u/10V  [CAPC3216X18N]
R403  0R  [RESC1608X05N]
R404  0R  [RESC1608X05N]
R405  0R  [RESC1608X05N]
U400  ISOW7841AQDWEQ1  [TI_DWE0016A]

### Ports
1_GND, 1_INA (in), 1_INB (in), 1_INC (in), 1_OUTD (out), 1_VCC, 2_GND, 2_IND (in), 2_OUTA (out), 2_OUTB (out), 2_OUTC (out), 2_VISO, SEL (in)

### Nets
GND1: C402.1 C403.1 U400.2(GND1) U400.8(GND1) ; port 1_GND
GND2: C404.1 C405.1 R405.1 U400.9(GND2) U400.15(GND2) ; port 2_GND
VCC1: C402.2 C403.2 R404.2 U400.1(VCC) ; port 1_VCC
VISO: C404.2 C405.2 R403.2 U400.16(VISO) ; port 2_VISO
1_INA: U400.3(INA) ; port 1_INA
1_INB: U400.4(INB) ; port 1_INB
1_INC: U400.5(INC) ; port 1_INC
1_OUTD: U400.6(OUTD) ; port 1_OUTD
2_IND: U400.11(IND) ; port 2_IND
2_OUTA: U400.14(OUTA) ; port 2_OUTA
2_OUTB: U400.13(OUTB) ; port 2_OUTB
2_OUTC: U400.12(OUTC) ; port 2_OUTC
SEL: R403.1 R405.2 U400.10(SEL) ; port SEL
NetR404_1: R404.1 U400.7(NC)

### Channels
alarm-interface-1/digital-isolator-alarm: designators end in _1; ports 1_GND=GND 1_INA=GND 1_INB=GND 1_INC=GND 1_OUTD=1_OUTD 1_VCC=PER_3.3V 2_GND=GND_ISO 2_IND=ALARM_1_IND 2_OUTA=ALARM_1_U_1 2_OUTB=ALARM_1_U_2 2_OUTC=ALARM_1_U_3 2_VISO=VISO SEL=ALARM_1_U_4
alarm-interface-2/digital-isolator-alarm: designators end in _2; ports 1_GND=GND 1_INA=GND 1_INB=GND 1_INC=GND 1_OUTD=1_OUTD 1_VCC=PER_3.3V 2_GND=GND_ISO 2_IND=ALARM_2_IND 2_OUTA=ALARM_2_U_1 2_OUTB=ALARM_2_U_2 2_OUTC=ALARM_2_U_3 2_VISO=VISO SEL=ALARM_2_U_4

### Notes on the sheet
- (near R403) connect SEL to VISO for VISO = 5V output
- 3.0V < VCC1 < 5.5V
- (near R405) connect SEL to GND2 for VISO = 3.3V output
- (near U400) 0R on pin 7 is for compatibility with ADUM6401
- do not place when using ISOW7841
- Fraunhofer IISB
- Schottkystr. 10
- developed by:
- 91058 Erlangen
- Germany
- Author
- Project
- License
- Description
- File
- Version
- Release Date
- Sheet
- foxbms.org <https://foxbms.org>
- www.iisb.fraunhofer.de <https://www.iisb.fraunhofer.de/>
- foxBMS Team
- /

### Library data of the parts
C402 C405 = gen_C_ceramic_22u_10V_X7R_1206: MLCC; Capacitance: 22u; Rated Voltage: 10V; Dielectric: X7R; Case EIA: 1206; Case Metric: 3216; Automotive Qualified: True; Part Number: gen_C_ceramic_22u_10V_X7R_1206; Supplier 1: Digikey; Supplier Part Number 1: 587-4243-1-ND
C403 C404 = gen_C_ceramic_100n_50V_X7R_0603: as C201 on sheet TPL-transceiver; Part Number: gen_C_ceramic_100n_50V_X7R_0603; Supplier 1: Farnell; Supplier Part Number 1: 2525267; ECCN: EAR99; Supplier 2: Digikey; Supplier Part Number 2: 490-6049-1-ND
R403-R405 = gen_R_0R_0603: SMD Resistor 0R 0603; Power: 0.1W; Case EIA: 0603; Case Metric: 1608; Maximum Working Voltage: 75V; PnP Package: 0603R; Automotive Qualified: True; PnP equipped: x; Part Number: gen_R_0R_0603; Operating Temperature: -55°C - +155°C; Resistance: 0R; Series: Jumper; PnP Value: 0R; Supplier 1: Farnell; Supplier Part Number 1: 2616580
U400 = ISOW7841AQDWEQ1: Automotive High-Performance, 5000-VRMS Reinforced Quad-Channel Digital Isolator With Integrated High-Efficiency, Low-Emissions DC-DC Converter; Manufacturer: Texas Instruments; PnP Package: SOIC-16; Automotive Qualified: True; AEC-Q Norm: AEC-Q100; AEC-Q Grade: Grade 1; Part Number: ISOW7841AQDWEQ1; Part Name: ISOW7841AQDWEQ1; Operating Temperature: −40°C - +125°C; ComponentLink1Description: Datasheet; ComponentLink1URL: https://www.ti.com/lit/ds/symlink/isow7841a-q1.pdf?ts=1619516874236; Supplier 1: Digikey; Supplier Part Number 1: 296-ISOW7841AQDWEQ1-ND; Supplier 2: Mouser; Supplier Part Number 2: 595-ISOW7841AQDWEQ1; ECCN: EAR99

## Nets that join several sheets
GND: foxbms2-interface-mc33664 (J100.32 J100.33 TP_GND.1), TPL-transceiver-1 (16 pins), TPL-transformer-1 (C300_1.2 C301_1.1), TPL-transformer-2 (C300_2.2 C301_2.1), TPL-transceiver-2 (16 pins), alarm-interface-1 (C400_1.1), alarm-interface-1/digital-isolator-alarm (7 pins), alarm-interface-2 (C400_2.1), alarm-interface-2/digital-isolator-alarm (7 pins)
GND_ISO: foxbms2-interface-mc33664 (J103.2), alarm-interface-1 (C401_1.1 D400_1.2 R402_1.2), alarm-interface-1/digital-isolator-alarm (5 pins)
GND_ISO: foxbms2-interface-mc33664 (J104.2), alarm-interface-2 (C401_2.1 D400_2.2 R402_2.2), alarm-interface-2/digital-isolator-alarm (5 pins)
PER_3.3V: foxbms2-interface-mc33664 (J100.34 J100.35 TP_PER_3.3V.1), TPL-transceiver-1 (6 pins), TPL-transceiver-2 (6 pins), alarm-interface-1/digital-isolator-alarm (C402_1.2 C403_1.2 R404_1.2 U400_1.1), alarm-interface-2/digital-isolator-alarm (C402_2.2 C403_2.2 R404_2.2 U400_2.1)
PER_5.0V: foxbms2-interface-mc33664 (J100.36 J100.37), TPL-transceiver-1 (C202_1.2 C203_1.2 C204_1.2 U200_1.16), TPL-transceiver-2 (C202_2.2 C203_2.2 C204_2.2 U200_2.16)
1_OUTD: alarm-interface-1 (R400_1.1), alarm-interface-1/digital-isolator-alarm (U400_1.6)
1_OUTD: alarm-interface-2 (R400_2.1), alarm-interface-2/digital-isolator-alarm (U400_2.6)
~{IF_INT0}: foxbms2-interface-mc33664 (J100.20 TP_INT1.1), TPL-transceiver-1 (R201_1.1 U200_1.8)
~{IF_INT1}: foxbms2-interface-mc33664 (J100.21 TP_INT2.1), TPL-transceiver-2 (R201_2.1 U200_2.8)
~{MCU_SPI1.CS1}: foxbms2-interface-mc33664 (J100.6 TP_SPI1.CS1.1), TPL-transceiver-1 (R200_1.1 U200_1.2)
~{MCU_SPI1.CS2}: foxbms2-interface-mc33664 (J100.7 TP_SPI1.CS2.1), TPL-transceiver-2 (R200_2.1 U200_2.2)
~{MCU_SPI4.CS0}: foxbms2-interface-mc33664 (J100.14 TP_SPI4.CS0.1), TPL-transceiver-1 (R202_1.1 R204_1.1)
~{MCU_SPI4.CS1}: foxbms2-interface-mc33664 (J100.15 TP_SPI4.CS1.1), TPL-transceiver-2 (R202_2.1 R204_2.1)
ALARM_1._P: foxbms2-interface-mc33664 (J103.1), alarm-interface-1 (R401_1.2)
ALARM_1_IND: alarm-interface-1 (C401_1.2 D400_1.1 R401_1.1 R402_1.1), alarm-interface-1/digital-isolator-alarm (U400_1.11)
ALARM_2._P: foxbms2-interface-mc33664 (J104.1), alarm-interface-2 (R401_2.2)
ALARM_2_IND: alarm-interface-2 (C401_2.2 D400_2.1 R401_2.1 R402_2.1), alarm-interface-2/digital-isolator-alarm (U400_2.11)
ALARM_OUT: foxbms2-interface-mc33664 (R104.2 R105.2 TP_ALARM_1.1), alarm-interface-1 (C400_1.2 R400_1.2)
ALARM_OUT: foxbms2-interface-mc33664 (R106.2 R107.2 TP_ALARM_2.1), alarm-interface-2 (C400_2.2 R400_2.2)
EN_1: foxbms2-interface-mc33664 (R100.2 R101.2 TP_EN1.1), TPL-transceiver-1 (R206_1.2 U200_1.4)
EN_2: foxbms2-interface-mc33664 (R102.2 R103.2 TP_EN2.1), TPL-transceiver-2 (R206_2.2 U200_2.4)
MCU_SPI1.CLK: foxbms2-interface-mc33664 (J100.5 TP_SPI1.CLK.1), TPL-transceiver-1 (U200_1.1), TPL-transceiver-2 (U200_2.1)
MCU_SPI1.SIMO0: foxbms2-interface-mc33664 (J100.3 TP_SPI1.SIMO0.1), TPL-transceiver-1 (U200_1.3), TPL-transceiver-2 (U200_2.3)
MCU_SPI4.CLK: foxbms2-interface-mc33664 (J100.13 TP_SPI4.CLK.1), TPL-transceiver-1 (R203_1.1 R207_1.2), TPL-transceiver-2 (R203_2.1 R207_2.2)
MCU_SPI4.SIMO: foxbms2-interface-mc33664 (J100.12 TP_SPI4.SIMO.1), TPL-transceiver-1 (R205_1.1 R208_1.2), TPL-transceiver-2 (R205_2.1 R208_2.2)
TPL_1._N: foxbms2-interface-mc33664 (J101.2), TPL-transformer-1 (T300_1.1)
TPL_1._P: foxbms2-interface-mc33664 (J101.1), TPL-transformer-1 (T300_1.3)
TPL_2._N: foxbms2-interface-mc33664 (J102.2), TPL-transformer-2 (T300_2.1)
TPL_2._P: foxbms2-interface-mc33664 (J102.1), TPL-transformer-2 (T300_2.3)
TPL_INT_N: TPL-transceiver-1 (C206_1.2 D201_1.1 U200_1.13), TPL-transformer-1 (R301_1.1 T300_1.12)
TPL_INT_N: TPL-transformer-2 (R301_2.1 T300_2.12), TPL-transceiver-2 (C206_2.2 D201_2.1 U200_2.13)
TPL_INT_P: TPL-transceiver-1 (C205_1.1 D200_1.2 U200_1.14), TPL-transformer-1 (R300_1.2 T300_1.10)
TPL_INT_P: TPL-transformer-2 (R300_2.2 T300_2.10), TPL-transceiver-2 (C205_2.1 D200_2.2 U200_2.14)

## Assembly variants
default: not fitted R101 R103 R105 R107 R403_1 R403_2
default-no-alarm: not fitted C400_1 C400_2 C401_1 C401_2 C402_1 C402_2 C403_1 C403_2 C404_1 C404_2 C405_1 C405_2 D400_1 D400_2 J103 J104 R101 R103 R104 R105 R106 R107 R400_1 R400_2 R401_1 R401_2 R402_1 R402_2 R403_1 R403_2 R404_1 R404_2 R405_1 R405_2 U400_1 U400_2